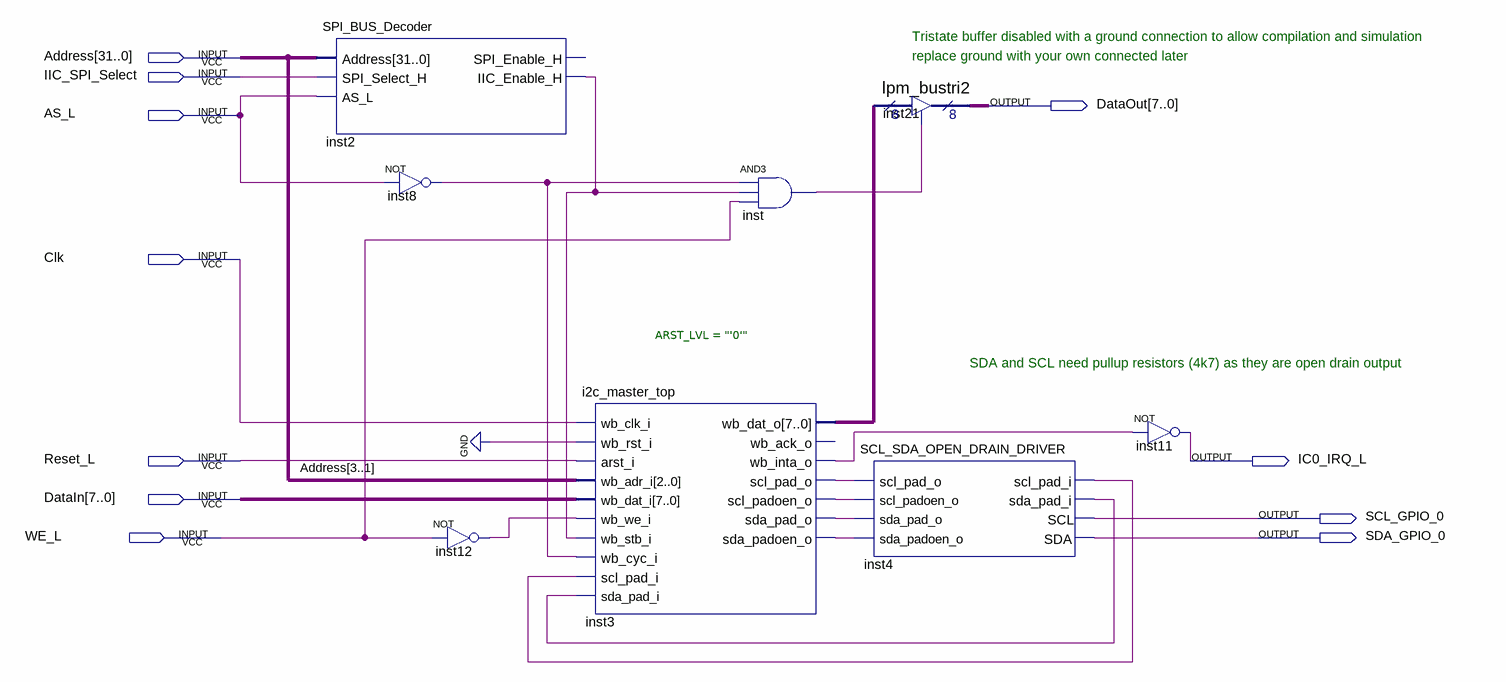
[diagram p0: schematic sheet]
// Quartus schematic IIC_SPI_Interface.bdf as structural Verilog: 8 symbols, 11 pins
module IIC_SPI_Interface (
  input  [31:0] Address,
  input  IIC_SPI_Select,
  input  AS_L,
  input  Clk,
  input  Reset_L,
  input  [7:0] DataIn,
  input  WE_L,
  output [7:0] DataOut,
  output IC0_IRQ_L,
  output SCL_GPIO_0,
  output SDA_GPIO_0
);

  wire inst2_iic_enable_h, inst3_scl_pad_o, inst3_scl_padoen_o, inst3_sda_pad_o, inst3_sda_padoen_o,
       inst3_wb_inta_o, inst4_scl_pad_i, inst4_sda_pad_i, inst8_out, inst12_out, inst_out;
  wire [7:0] inst3_wb_dat_o;

  SPI_BUS_Decoder inst2 (
    .Address(Address), .SPI_Select_H(IIC_SPI_Select), .AS_L(AS_L), .IIC_Enable_H(inst2_iic_enable_h));  // open: SPI_Enable_H
  not inst8 (inst8_out, AS_L);
  not inst12 (inst12_out, WE_L);
  i2c_master_top #(.ARST_LVL("'0'")) inst3 (
    .wb_clk_i(Clk), .wb_rst_i(1'b0), .arst_i(Reset_L), .wb_adr_i(Address[3:1]), .wb_dat_i(DataIn),
    .wb_we_i(inst12_out), .wb_stb_i(inst2_iic_enable_h), .wb_cyc_i(inst8_out), .scl_pad_i(inst4_scl_pad_i),
    .sda_pad_i(inst4_sda_pad_i), .wb_dat_o(inst3_wb_dat_o), .wb_inta_o(inst3_wb_inta_o),
    .scl_pad_o(inst3_scl_pad_o), .scl_padoen_o(inst3_scl_padoen_o), .sda_pad_o(inst3_sda_pad_o),
    .sda_padoen_o(inst3_sda_padoen_o));  // open: wb_ack_o
  and inst (inst_out, inst8_out, inst2_iic_enable_h, WE_L);
  lpm_bustri2 inst21 (.enabledt(inst_out), .data(inst3_wb_dat_o), .tridata(DataOut));
  SCL_SDA_OPEN_DRAIN_DRIVER inst4 (
    .scl_pad_o(inst3_scl_pad_o), .scl_padoen_o(inst3_scl_padoen_o), .sda_pad_o(inst3_sda_pad_o),
    .sda_padoen_o(inst3_sda_padoen_o), .scl_pad_i(inst4_scl_pad_i), .sda_pad_i(inst4_sda_pad_i),
    .SCL(SCL_GPIO_0), .SDA(SDA_GPIO_0));
  not inst11 (IC0_IRQ_L, inst3_wb_inta_o);

  // Notes on the sheet:
  //   Tristate buffer disabled with a ground connection to allow compilation and simulation
  //   replace ground with your own connected later
  //   SDA and SCL need pullup resistors (4k7) as they are open drain output
endmodule
